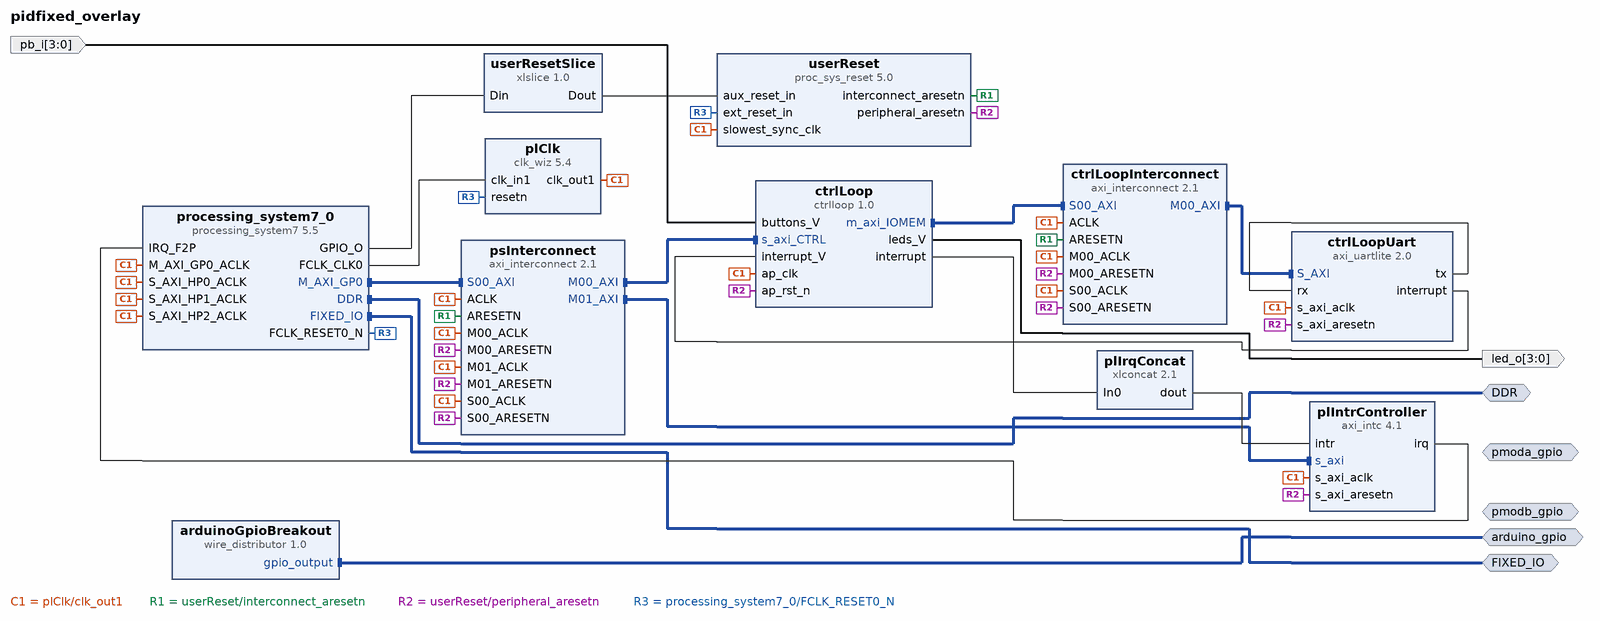
[diagram p0: block diagram of the top level]
# Vivado block design pidfixed_overlay, xc7z020clg400-1, Vivado 2017.4
create_bd_design pidfixed_overlay

create_bd_intf_port -mode Master -vlnv xilinx.com:interface:ddrx_rtl:1.0 DDR
create_bd_intf_port -mode Master -vlnv xilinx.com:display_processing_system7:fixedio_rtl:1.0 FIXED_IO
create_bd_intf_port -mode Master -vlnv xilinx.com:interface:gpio_rtl:1.0 arduino_gpio
create_bd_intf_port -mode Master -vlnv xilinx.com:interface:gpio_rtl:1.0 pmoda_gpio
create_bd_intf_port -mode Master -vlnv xilinx.com:interface:gpio_rtl:1.0 pmodb_gpio
create_bd_port -dir O -from 3 -to 0 led_o
create_bd_port -dir I -from 3 -to 0 pb_i

create_bd_cell -type ip -vlnv xilinx.com:user:wire_distributor:1.0 arduinoGpioBreakout
set_property -dict {CONFIG.TYPE 1 CONFIG.WIDTH 20} [get_bd_cells arduinoGpioBreakout]
create_bd_cell -type ip -vlnv UCSD:hlsip:ctrlloop:1.0 ctrlLoop
create_bd_cell -type ip -vlnv xilinx.com:ip:axi_interconnect:2.1 ctrlLoopInterconnect
set_property -dict {CONFIG.NUM_MI 1} [get_bd_cells ctrlLoopInterconnect]
create_bd_cell -type ip -vlnv xilinx.com:ip:axi_uartlite:2.0 ctrlLoopUart
create_bd_cell -type ip -vlnv xilinx.com:ip:clk_wiz:5.4 plClk
set_property -dict {CONFIG.USE_LOCKED false CONFIG.RESET_PORT resetn CONFIG.RESET_TYPE ACTIVE_LOW} [get_bd_cells plClk]
create_bd_cell -type ip -vlnv xilinx.com:ip:axi_intc:4.1 plIntrController
create_bd_cell -type ip -vlnv xilinx.com:ip:xlconcat:2.1 plIrqConcat
set_property -dict {CONFIG.NUM_PORTS 1} [get_bd_cells plIrqConcat]
create_bd_cell -type ip -vlnv xilinx.com:ip:processing_system7:5.5 processing_system7_0
set_property -dict [list \
  CONFIG.PCW_FCLK_CLK1_BUF TRUE \
  CONFIG.PCW_UIPARAM_DDR_FREQ_MHZ 525 \
  CONFIG.PCW_CRYSTAL_PERIPHERAL_FREQMHZ 50 \
  CONFIG.PCW_APU_PERIPHERAL_FREQMHZ 650 \
  CONFIG.PCW_SDIO_PERIPHERAL_FREQMHZ 50 \
  CONFIG.PCW_UART_PERIPHERAL_FREQMHZ 100 \
  CONFIG.PCW_FPGA0_PERIPHERAL_FREQMHZ 100 \
  CONFIG.PCW_FPGA1_PERIPHERAL_FREQMHZ 50 \
  CONFIG.PCW_FPGA2_PERIPHERAL_FREQMHZ 100 \
  CONFIG.PCW_FPGA3_PERIPHERAL_FREQMHZ 160 \
  CONFIG.PCW_USE_S_AXI_HP0 1 \
  CONFIG.PCW_USE_S_AXI_HP1 1 \
  CONFIG.PCW_USE_S_AXI_HP2 1 \
  CONFIG.PCW_USE_FABRIC_INTERRUPT 1 \
  CONFIG.PCW_GPIO_EMIO_GPIO_WIDTH 7 \
  CONFIG.PCW_EN_CLK1_PORT 1 \
  CONFIG.PCW_IRQ_F2P_INTR 1 \
  CONFIG.PCW_GP0_EN_MODIFIABLE_TXN 0 \
  CONFIG.PCW_GP1_EN_MODIFIABLE_TXN 0 \
  CONFIG.PCW_PERIPHERAL_BOARD_PRESET None \
  CONFIG.PCW_PRESET_BANK1_VOLTAGE {LVCMOS 1.8V} \
  CONFIG.PCW_UIPARAM_DDR_BUS_WIDTH {16 Bit} \
  CONFIG.PCW_UIPARAM_DDR_PARTNO Custom \
  CONFIG.PCW_QSPI_PERIPHERAL_ENABLE 1 \
  CONFIG.PCW_QSPI_QSPI_IO {MIO 1 .. 6} \
  CONFIG.PCW_QSPI_GRP_SINGLE_SS_ENABLE 1 \
  CONFIG.PCW_QSPI_GRP_SINGLE_SS_IO {MIO 1 .. 6} \
  CONFIG.PCW_SINGLE_QSPI_DATA_MODE x4 \
  CONFIG.PCW_QSPI_GRP_FBCLK_ENABLE 1 \
  CONFIG.PCW_QSPI_GRP_FBCLK_IO {MIO 8} \
  CONFIG.PCW_ENET0_PERIPHERAL_ENABLE 1 \
  CONFIG.PCW_ENET0_ENET0_IO {MIO 16 .. 27} \
  CONFIG.PCW_ENET0_GRP_MDIO_ENABLE 1 \
  CONFIG.PCW_ENET0_GRP_MDIO_IO {MIO 52 .. 53} \
  CONFIG.PCW_SD0_PERIPHERAL_ENABLE 1 \
  CONFIG.PCW_SD0_SD0_IO {MIO 40 .. 45} \
  CONFIG.PCW_SD0_GRP_CD_ENABLE 1 \
  CONFIG.PCW_SD0_GRP_CD_IO {MIO 47} \
  CONFIG.PCW_SD0_GRP_WP_ENABLE 0 \
  CONFIG.PCW_UART0_PERIPHERAL_ENABLE 1 \
  CONFIG.PCW_UART0_UART0_IO {MIO 14 .. 15} \
  CONFIG.PCW_UART1_PERIPHERAL_ENABLE 0 \
  CONFIG.PCW_USB0_PERIPHERAL_ENABLE 1 \
  CONFIG.PCW_USB0_USB0_IO {MIO 28 .. 39} \
  CONFIG.PCW_GPIO_MIO_GPIO_ENABLE 0 \
  CONFIG.PCW_GPIO_EMIO_GPIO_ENABLE 1 \
  CONFIG.PCW_GPIO_EMIO_GPIO_IO 7 \
  CONFIG.PCW_FPGA_FCLK1_ENABLE 1 \
] [get_bd_cells processing_system7_0]
# 479 more settings of processing_system7_0 are not shown: defaults, MIO pin electricals, DDR timing, and values the tool derives
create_bd_cell -type ip -vlnv xilinx.com:ip:axi_interconnect:2.1 psInterconnect
set_property -dict {CONFIG.NUM_MI 2} [get_bd_cells psInterconnect]
create_bd_cell -type ip -vlnv xilinx.com:ip:proc_sys_reset:5.0 userReset
create_bd_cell -type ip -vlnv xilinx.com:ip:xlslice:1.0 userResetSlice
set_property -dict {CONFIG.DIN_TO 0 CONFIG.DIN_FROM 0 CONFIG.DIN_WIDTH 7} [get_bd_cells userResetSlice]

# ---- connections ----

connect_bd_intf_net [get_bd_intf_pins processing_system7_0/M_AXI_GP0] [get_bd_intf_pins psInterconnect/S00_AXI]
connect_bd_intf_net -intf_net axi_interconnect_0_M00_AXI [get_bd_intf_pins ctrlLoopInterconnect/M00_AXI] [get_bd_intf_pins ctrlLoopUart/S_AXI]
connect_bd_intf_net [get_bd_intf_pins ctrlLoop/m_axi_IOMEM] [get_bd_intf_pins ctrlLoopInterconnect/S00_AXI]
connect_bd_intf_net [get_bd_intf_pins ctrlLoop/s_axi_CTRL] [get_bd_intf_pins psInterconnect/M00_AXI]
connect_bd_intf_net [get_bd_intf_pins plIntrController/s_axi] [get_bd_intf_pins psInterconnect/M01_AXI]
connect_bd_intf_net [get_bd_intf_ports DDR] [get_bd_intf_pins processing_system7_0/DDR]
connect_bd_intf_net [get_bd_intf_ports FIXED_IO] [get_bd_intf_pins processing_system7_0/FIXED_IO]
connect_bd_intf_net -intf_net distributor_arduino_gpio_gpio_output [get_bd_intf_ports arduino_gpio] [get_bd_intf_pins arduinoGpioBreakout/gpio_output]
connect_bd_net -net FCLK_CLK0 [get_bd_pins plClk/clk_out1] \
  [get_bd_pins ctrlLoop/ap_clk] [get_bd_pins ctrlLoopUart/s_axi_aclk] [get_bd_pins plIntrController/s_axi_aclk] \
  [get_bd_pins processing_system7_0/M_AXI_GP0_ACLK] [get_bd_pins processing_system7_0/S_AXI_HP0_ACLK] \
  [get_bd_pins processing_system7_0/S_AXI_HP1_ACLK] [get_bd_pins processing_system7_0/S_AXI_HP2_ACLK] \
  [get_bd_pins userReset/slowest_sync_clk] [get_bd_pins ctrlLoopInterconnect/ACLK] \
  [get_bd_pins ctrlLoopInterconnect/M00_ACLK] [get_bd_pins ctrlLoopInterconnect/S00_ACLK] [get_bd_pins psInterconnect/ACLK] \
  [get_bd_pins psInterconnect/M00_ACLK] [get_bd_pins psInterconnect/M01_ACLK] [get_bd_pins psInterconnect/S00_ACLK]
connect_bd_net -net S00_ARESETN_1 [get_bd_pins userReset/interconnect_aresetn] \
  [get_bd_pins ctrlLoopInterconnect/ARESETN] [get_bd_pins psInterconnect/ARESETN]
connect_bd_net -net S00_ARESETN_2 [get_bd_pins userReset/peripheral_aresetn] \
  [get_bd_pins ctrlLoop/ap_rst_n] [get_bd_pins ctrlLoopUart/s_axi_aresetn] [get_bd_pins plIntrController/s_axi_aresetn] \
  [get_bd_pins ctrlLoopInterconnect/M00_ARESETN] [get_bd_pins ctrlLoopInterconnect/S00_ARESETN] \
  [get_bd_pins psInterconnect/M00_ARESETN] [get_bd_pins psInterconnect/M01_ARESETN] [get_bd_pins psInterconnect/S00_ARESETN]
connect_bd_net -net axi_intc_0_irq [get_bd_pins plIntrController/irq] [get_bd_pins processing_system7_0/IRQ_F2P]
connect_bd_net [get_bd_pins ctrlLoopUart/interrupt] [get_bd_pins ctrlLoop/interrupt_V]
connect_bd_net [get_bd_pins ctrlLoopUart/tx] [get_bd_pins ctrlLoopUart/rx]
connect_bd_net -net ctrlloop_0_interrupt [get_bd_pins ctrlLoop/interrupt] [get_bd_pins plIrqConcat/In0]
connect_bd_net [get_bd_pins ctrlLoop/leds_V] [get_bd_ports led_o]
connect_bd_net [get_bd_ports pb_i] [get_bd_pins ctrlLoop/buttons_V]
connect_bd_net [get_bd_pins plIrqConcat/dout] [get_bd_pins plIntrController/intr]
connect_bd_net [get_bd_pins processing_system7_0/FCLK_CLK0] [get_bd_pins plClk/clk_in1]
connect_bd_net [get_bd_pins processing_system7_0/FCLK_RESET0_N] [get_bd_pins plClk/resetn] [get_bd_pins userReset/ext_reset_in]
connect_bd_net [get_bd_pins processing_system7_0/GPIO_O] [get_bd_pins userResetSlice/Din]
connect_bd_net -net resetSlice_Dout [get_bd_pins userResetSlice/Dout] [get_bd_pins userReset/aux_reset_in]

# ---- address map ----
assign_bd_address -offset 0x00000000 -range 4K -target_address_space [get_bd_addr_spaces ctrlLoop/Data_m_axi_IOMEM] [get_bd_addr_segs ctrlLoopUart/S_AXI/Reg]
assign_bd_address -offset 0x40000000 -range 4K -target_address_space [get_bd_addr_spaces processing_system7_0/Data] [get_bd_addr_segs ctrlLoop/s_axi_CTRL/Reg]
assign_bd_address -offset 0x40001000 -range 4K -target_address_space [get_bd_addr_spaces processing_system7_0/Data] [get_bd_addr_segs plIntrController/S_AXI/Reg]

validate_bd_design
save_bd_design
